# Altium schematic sheet EntireSchematic.SchDoc
size A; SheetNumber: 1; SheetTotal: 1
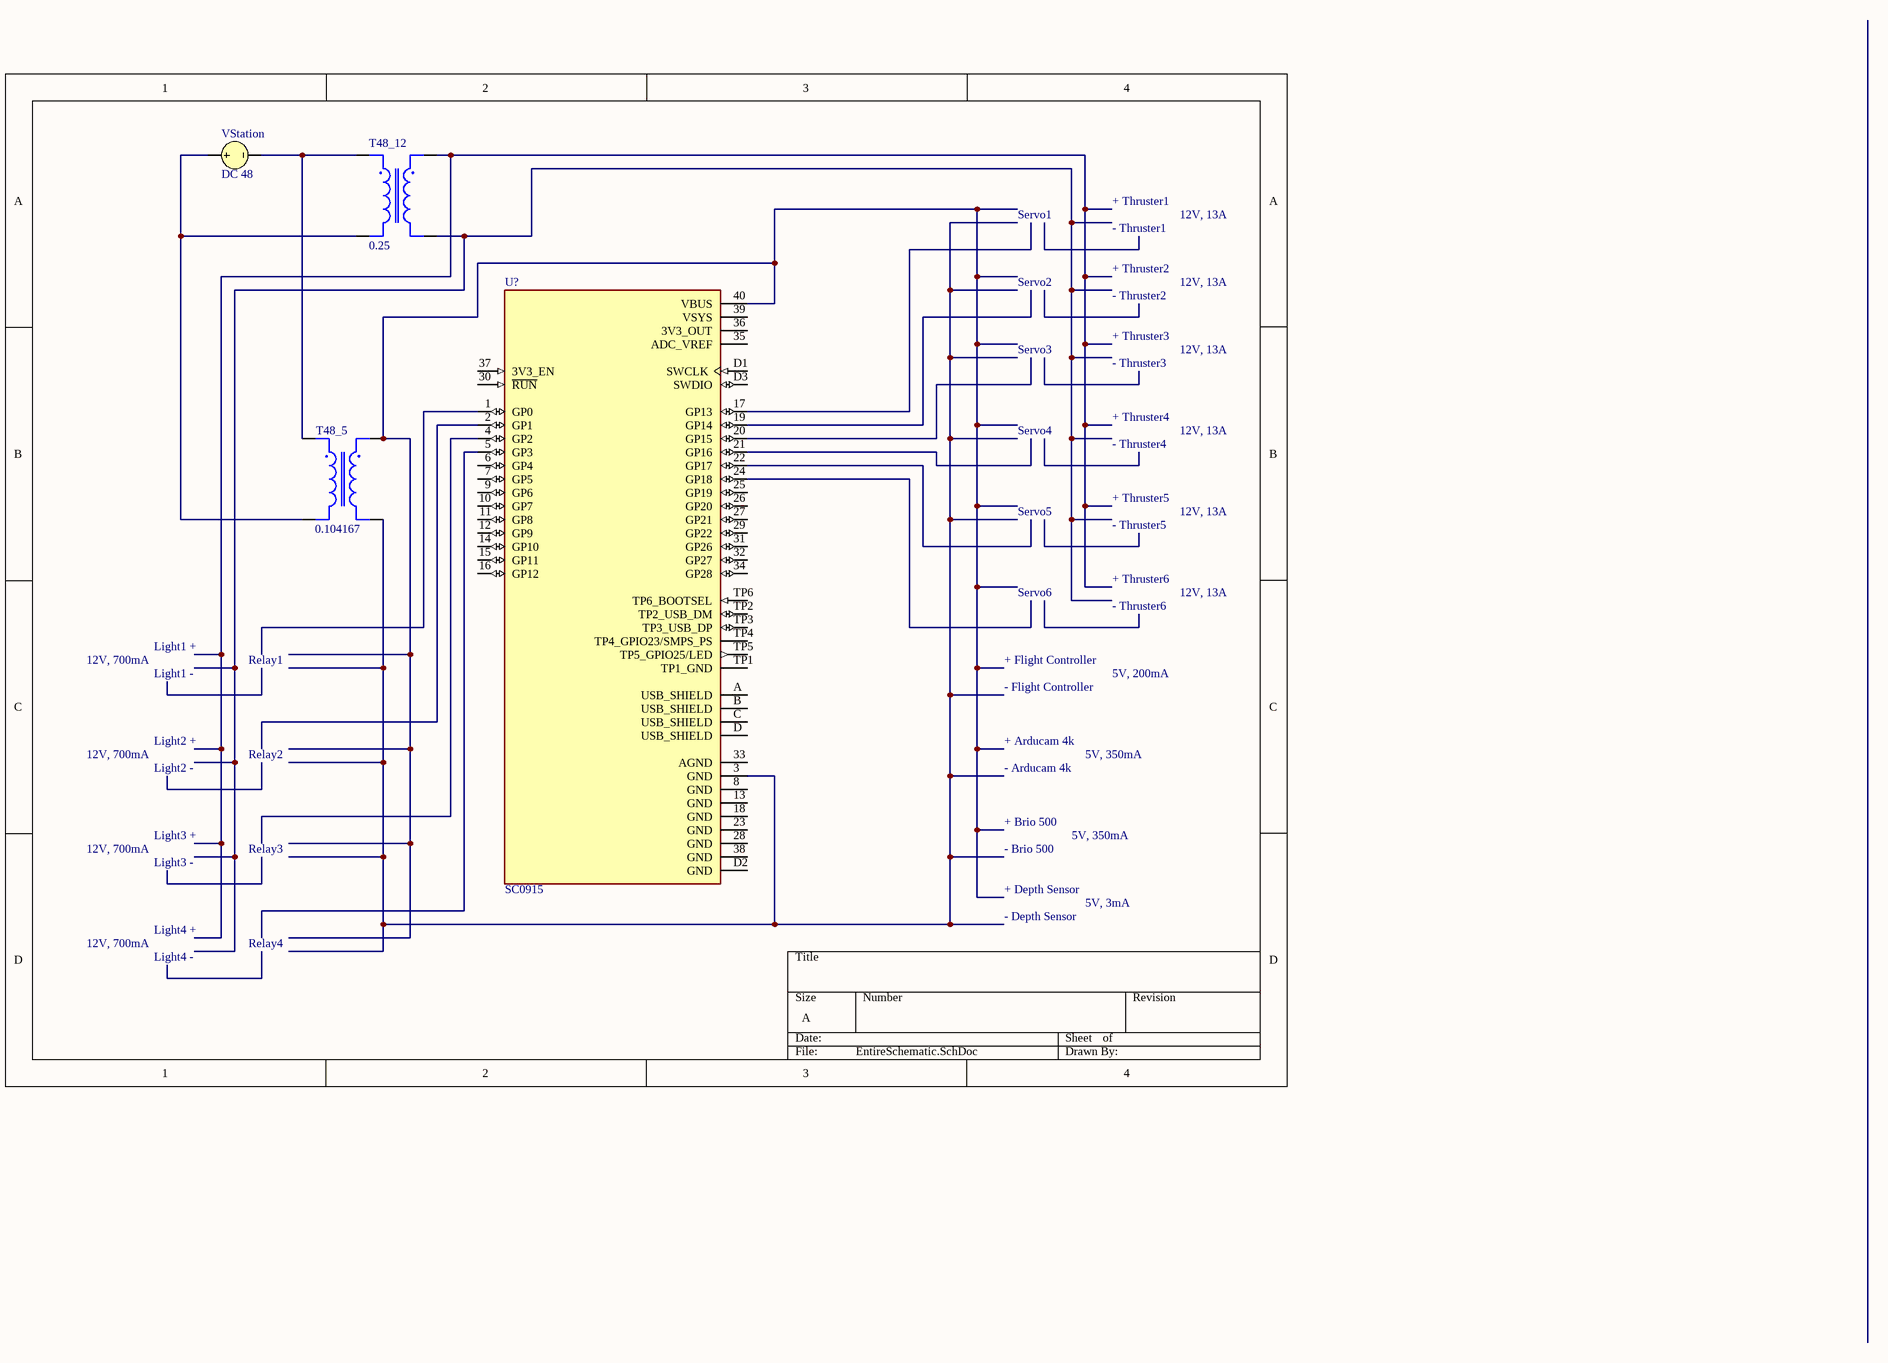
[diagram p0: EntireSchematic.SchDoc]

## Parts
T48_5  GAIN: 0.104167  (hidden comment: Ideal Transformer)
T48_12  GAIN: 0.25  (hidden comment: Ideal Transformer)
U?  SC0915  [MODULE_SC0915]
VStation  DC 48

## Nets
NetT48_5_1: T48_5.1 T48_12.1 VStation.2
NetT48_5_2: T48_5.2 T48_12.2 VStation.1
NetT48_5_3: T48_5.3 U?.40(VBUS)
NetT48_5_4: T48_5.4 U?.3(GND)

Not connected (* = marked no-connect by the designer): T48_12 3 4; U? 1(GP0) 2(GP1) 4(GP2) 5(GP3) 6(GP4) 7(GP5) 8(GND) 9(GP6) 10(GP7) 11(GP8) 12(GP9) 13(GND) 14(GP10) 15(GP11) 16(GP12) 17(GP13) 18(GND) 19(GP14) 20(GP15) 21(GP16) 22(GP17) 23(GND) 24(GP18) 25(GP19) 26(GP20) 27(GP21) 28(GND) 29(GP22) 30(~{RUN}) 31(GP26) 32(GP27) 33(AGND) 34(GP28) 35(ADC_VREF) 36(3V3_OUT) 37(3V3_EN) 38(GND) 39(VSYS) A(USB_SHIELD) B(USB_SHIELD) C(USB_SHIELD) D(USB_SHIELD) D1(SWCLK) D2(GND) D3(SWDIO) TP1(TP1_GND) TP2(TP2_USB_DM) TP3(TP3_USB_DP) TP4(TP4_GPIO23/SMPS_PS) TP5(TP5_GPIO25/LED) TP6(TP6_BOOTSEL)

## Notes on the sheet
- Servo1
- + Thruster1
- - Thruster1
- 12V, 13A
- Servo2
- + Thruster2
- - Thruster2
- Servo3
- + Thruster3
- - Thruster3
- Servo4
- + Thruster4
- - Thruster4
- + Thruster5
- Servo5
- - Thruster5
- Servo6
- + Thruster6
- - Thruster6
- 12V, 700mA
- Light1 +
- Light1 -
- Relay1
- + Flight Controller
- - Flight Controller
- 5V, 200mA
- Light2 +
- Light2 -
- Relay2
- + Arducam 4k
- - Arducam 4k
- 5V, 350mA
- Light3 +
- + Brio 500
- Light3 -
- Relay3
- - Brio 500
- + Depth Sensor
- 5V, 3mA
- Light4 +
- Light4 -
- Relay4
- - Depth Sensor

## Library data of the parts
T48_5 T48_12 = Transformer Ideal: SimulationGenericComponent: True
U? = SC0915: RP2040 Raspberry Pi Pico series ARMÂ® CortexÂ®-M0+ MCU 32-Bit Embedded Evaluation Board; SnapEDA_Link: https://www.snapeda.com/parts/SC0915/Raspberry+Pi/view-part/?ref=snap; Availability: In Stock; Package: None; Price: None; MP: SC0915; Check_prices: https://www.snapeda.com/parts/SC0915/Raspberry+Pi/view-part/?ref=eda; MF: Raspberry Pi; Value: *; Purchase-URL: https://pricing.snapeda.com/search/part/SC0915/?ref=eda
VStation = VSRC: Voltage Source; Note: PCB Footprint - Not required; AC Magnitude: 1; AC Phase: 0; Value: 48; Published: 8-Jun-2000; LatestRevisionDate: 17-Jul-2002; LatestRevisionNote: Re-released for DXP Platform.; PackageReference: Not Applicable; Publisher: Altium Limited